# Altium project final_schmatic.PrjPCB
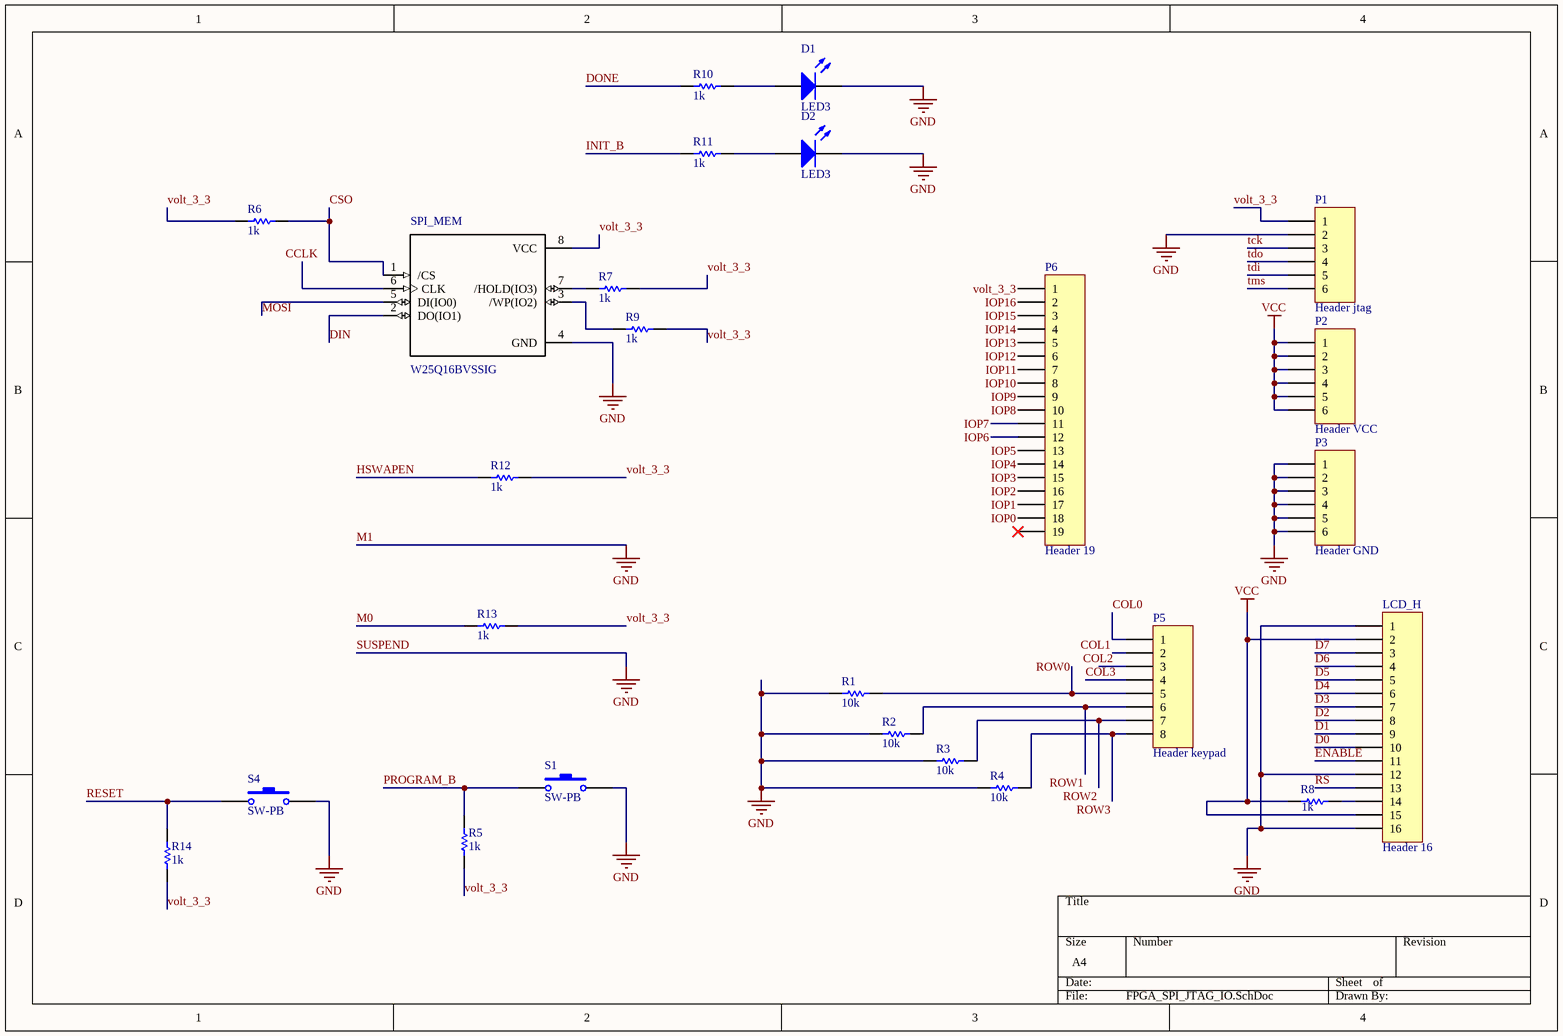
[diagram p0: FPGA_SPI_JTAG_IO.SchDoc]
5 sheets, 58 parts. Net scope: global (net labels, ports and power ports of the same name join across sheets).
Board file: PCB1.PcbDoc
Sheets:
  FPGA_SPI_JTAG_IO.SchDoc
  project1.SchDoc
  Sheet5.SchDoc
  Sheet4.SchDoc
  Sheet1.SchDoc

## Sheet FPGA_SPI_JTAG_IO.SchDoc
size A4

### Parts
D1  LED3  [3.5X2.8X1.9]
D2  LED3  [3.5X2.8X1.9]
LCD_H  Header 16  [HDR1X16]
P1  Header jtag  [HDR1X6]
P2  Header VCC  [HDR1X6]
P3  Header GND  [HDR1X6]
P5  Header keypad  [HDR1X8]
P6  Header 19  [HDR1X19]
R1  10k  [ERA-0805]
R2  10k  [ERA-0805]
R3  10k  [ERA-0805]
R4  10k  [ERA-0805]
R5  1k  [ERA-0805]
R6  1k  [ERA-0805]
R7  1k  [ERA-0805]
R8  1k  [ERA-0805]
R9  1k  [ERA-0805]
R10  1k  [ERA-0805]
R11  1k  [ERA-0805]
R12  1k  [ERA-0805]
R13  1k  [ERA-0805]
R14  1k  [ERA-0805]
S1  SW-PB  [SPST-2]
S4  SW-PB  [SPST-2]
SPI_MEM  W25Q16BVSSIG  [*SOIC127P790X216-8N]

### Nets
M1: D1.2(K) D2.2(K) LCD_H.1 LCD_H.12 LCD_H.16 P1.2 P3.1 P3.2 P3.3 P3.4 P3.5 P3.6 R1.1 R2.1 R3.1 R4.1 S1.2 S4.2 SPI_MEM.4(GND)  [also labelled GND, SUSPEND]
VCC: LCD_H.2 LCD_H.15 P2.1 P2.2 P2.3 P2.4 P2.5 P2.6 R8.1
volt_3_3: P1.1 P6.1 R5.1 R6.1 R7.1 R9.1 R12.1 R13.1 R14.1 SPI_MEM.8(VCC)
CCLK: SPI_MEM.6(CLK)
COL0: P5.1
COL1: P5.2
COL2: P5.3
COL3: P5.4
CSO: R6.2 SPI_MEM.1(/CS)
D0: LCD_H.10
D1: LCD_H.9
D2: LCD_H.8
D3: LCD_H.7
D4: LCD_H.6
D5: LCD_H.5
D6: LCD_H.4
D7: LCD_H.3
DIN: SPI_MEM.2(DO(IO1))
DONE: R10.1
ENABLE: LCD_H.11
HSWAPEN: R12.2
INIT_B: R11.1
IOP0: P6.18
IOP1: P6.17
IOP2: P6.16
IOP3: P6.15
IOP4: P6.14
IOP5: P6.13
IOP6: P6.12
IOP7: P6.11
IOP8: P6.10
IOP9: P6.9
IOP10: P6.8
IOP11: P6.7
IOP12: P6.6
IOP13: P6.5
IOP14: P6.4
IOP15: P6.3
IOP16: P6.2
M0: R13.2
MOSI: SPI_MEM.5(DI(IO0))
PROGRAM_B: R5.2 S1.1
RESET: R14.2 S4.1
ROW0: P5.5 R1.2
ROW1: P5.6 R2.2
ROW2: P5.7 R3.2
ROW3: P5.8 R4.2
RS: LCD_H.13
tck: P1.3
tdi: P1.5
tdo: P1.4
tms: P1.6
NetD1_1: D1.1(A) R10.2
NetD2_1: D2.1(A) R11.2
NetLCD_H_14: LCD_H.14 R8.2
NetR7_2: R7.2 SPI_MEM.7(/HOLD(IO3))
NetR9_2: R9.2 SPI_MEM.3(/WP(IO2))

Not connected (* = marked no-connect by the designer): P6 19*

### Library data of the parts
D1 D2 = LED3: Typical BLUE SiC LED; Published: 8-Jun-2000; LatestRevisionDate: 17-Dec-2003; LatestRevisionNote: PCB Footprint replaced.; DatasheetVersion: 16-Apr-2002; PackageVersion: 16-Apr-2002; PackageReference: 3.5X2.8X1.9; Publisher: Altium Limited; PackageDescription: SM LED; 2 C-Bend Leads; Body 3.5 x 2.8 x 1.9 mm, inc leads (LxWxH typ)
LCD_H = Header 16: Header, 16-Pin; LatestRevisionDate: 17-Jul-2002; LatestRevisionNote: Re-released for DXP Platform.; Publisher: Altium Limited
P1-P3 = Header 6: Header, 6-Pin; LatestRevisionDate: 17-Jul-2002; LatestRevisionNote: Re-released for DXP Platform.; Publisher: Altium Limited
P5 = Header 8: Header, 8-Pin; LatestRevisionDate: 17-Jul-2002; LatestRevisionNote: Re-released for DXP Platform.; Publisher: Altium Limited
P6 = Header 19: Header, 19-Pin; LatestRevisionDate: 17-Jul-2002; LatestRevisionNote: Re-released for DXP Platform.; Publisher: Altium Limited
R1-R14 = ERA6Y: Rectangular Thick Film Chip Resistor, 10 Ohm to 1M Ohm Range, 0.1% and 0.5% Tolerance, 0805 Size, 0.1 W; Note: If flow soldering, adjust pad width of PCB Footprint to 0.7 - 0.8 times the width of the resistor.; Published: 17-Dec-2003; LatestRevisionDate: 19-Mar-2004; LatestRevisionNote: Silkscreen size reduced.; PackageDocument: Mar-2003; PackageReference: ERA-0805; Publisher: Altium Limited; Code_IPC: 2012 [0805]; ComponentLink1Description: Manufacturer Link; ComponentLink1URL: http://www.panasonic.com/industrial/components/resistive_products.htm; ComponentLink2Description: Datasheet; ComponentLink2URL: http://www.panasonic.com/industrial/components/pdf/AOA0000CE8.pdf
S1 S4 = SW-PB: Switch; Published: 24-Mar-1999; LatestRevisionDate: 17-Jul-2002; LatestRevisionNote: Re-released for DXP Platform.; PackageReference: SPST-2; Publisher: Altium Limited; PackageDescription: Switch; 2 Leads
SPI_MEM = W25Q16BVSSIG: Flash, pin, soic, flash, Memory, Semiconductors and Actives, serial, ic; MF: Winbond; SnapEDA_Link: https://www.snapeda.com/parts/W25Q16BVSSIG/Winbond%20Electronics/view-part/?ref=snap; Digi-Key_Part_Number: W25Q16BVSSIG-ND; MP: W25Q16BVSSIG; Digi-Key_Purchase_URL: https://www.digikey.com/product-detail/en/winbond-electronics/W25Q16BVSSIG/W25Q16BVSSIG-ND/2208449?utm_source=snapeda&utm_medium=aggregator&utm_campaign=symbol; Package: SOIC-8 Winbond; Value: *

## Sheet project1.SchDoc
size A
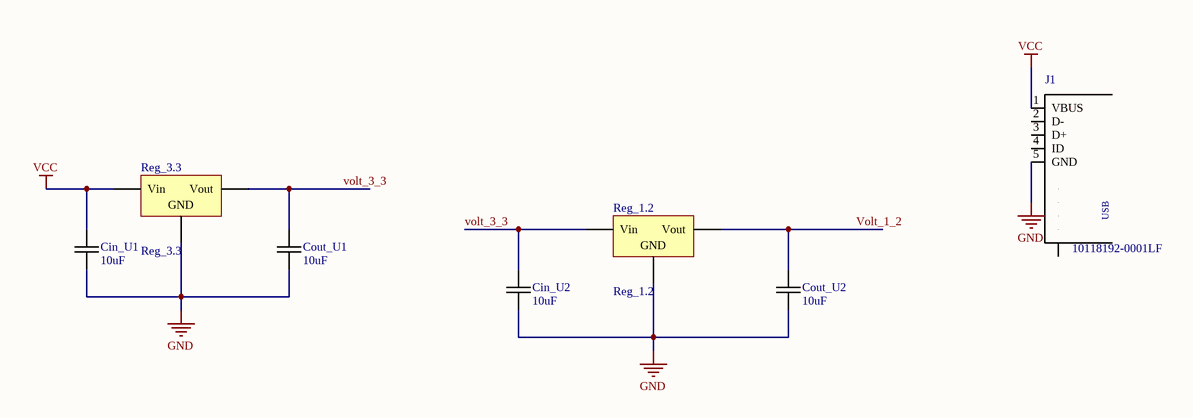
[diagram p1: project1.SchDoc]

### Parts
Cin_U1  10uF  [0805C-GENERIC]
Cin_U2  10uF  [0805C-GENERIC]
Cout_U1  10uF  [0805C-GENERIC]
Cout_U2  10uF  [0805C-GENERIC]
J1  10118192-0001LF  [10118192-0001LF_10118192-0001LF(Primary)]
Reg_1.2  Reg_1.2  [D2PAK_N]
Reg_3.3  Reg_3.3  [D2PAK_N]

### Nets
GND: Cin_U1.2 Cin_U2.2 Cout_U1.2 Cout_U2.2 J1.5(GND) Reg_1.2.2(GND) Reg_3.3.2(GND)  [project net M1]
VCC: Cin_U1.1 J1.1(VBUS) Reg_3.3.1(Vin)
Volt_1_2: Cout_U2.1 Reg_1.2.3(Vout)
volt_3_3: Cin_U2.1 Cout_U1.1 Reg_1.2.1(Vin) Reg_3.3.3(Vout)

Not connected (* = marked no-connect by the designer): J1 2(D-) 3(D+) 4(ID) M1(S) M2(S) S1(S) S2(S) S3(S) S4(S)

### Notes on the sheet
- (in symbol 10118192-0001LF) USB

### Library data of the parts
Cin_U1 Cin_U2 Cout_U1 Cout_U2 = 0805C-10UF-16V-X5R-TDK: CAPACITOR 0805 CERAMIC; Manufacturer Part Number: C2012X5R1C106M; Manufacturer: TDK Corporation; REEL: C63; Supplier 1: Digi-Key; Supplier Part Number 1: 445-4115-2-ND
J1 = 10118192-0001LF: Conn Micro USB Type B RCP 5 POS 0.65mm Solder RA SMD 5 Terminal 1 Port T/R; MF: Amphenol; Price: 0.23 USD; MP: 10118192-0001LF; Availability: Good; SnapEDA_Link: https://www.snapeda.com/parts/10118192-0001LF/Amphenol%20Solar/view-part/?ref=snap; Package: None; Value: *
Reg_1.2 Reg_3.3 = Volt Reg: Voltage Regulator; Published: 24-Mar-1999; LatestRevisionDate: 29-May-2009; LatestRevisionNote: IPC-7351 Footprint Added.; PackageReference: D2PAK; Publisher: Altium Limited; PackageDescription: 3-Pin Transistor Outline Package 2.54 mm Pitch, 15.1 mm Lead Span

## Sheet Sheet5.SchDoc
size A4
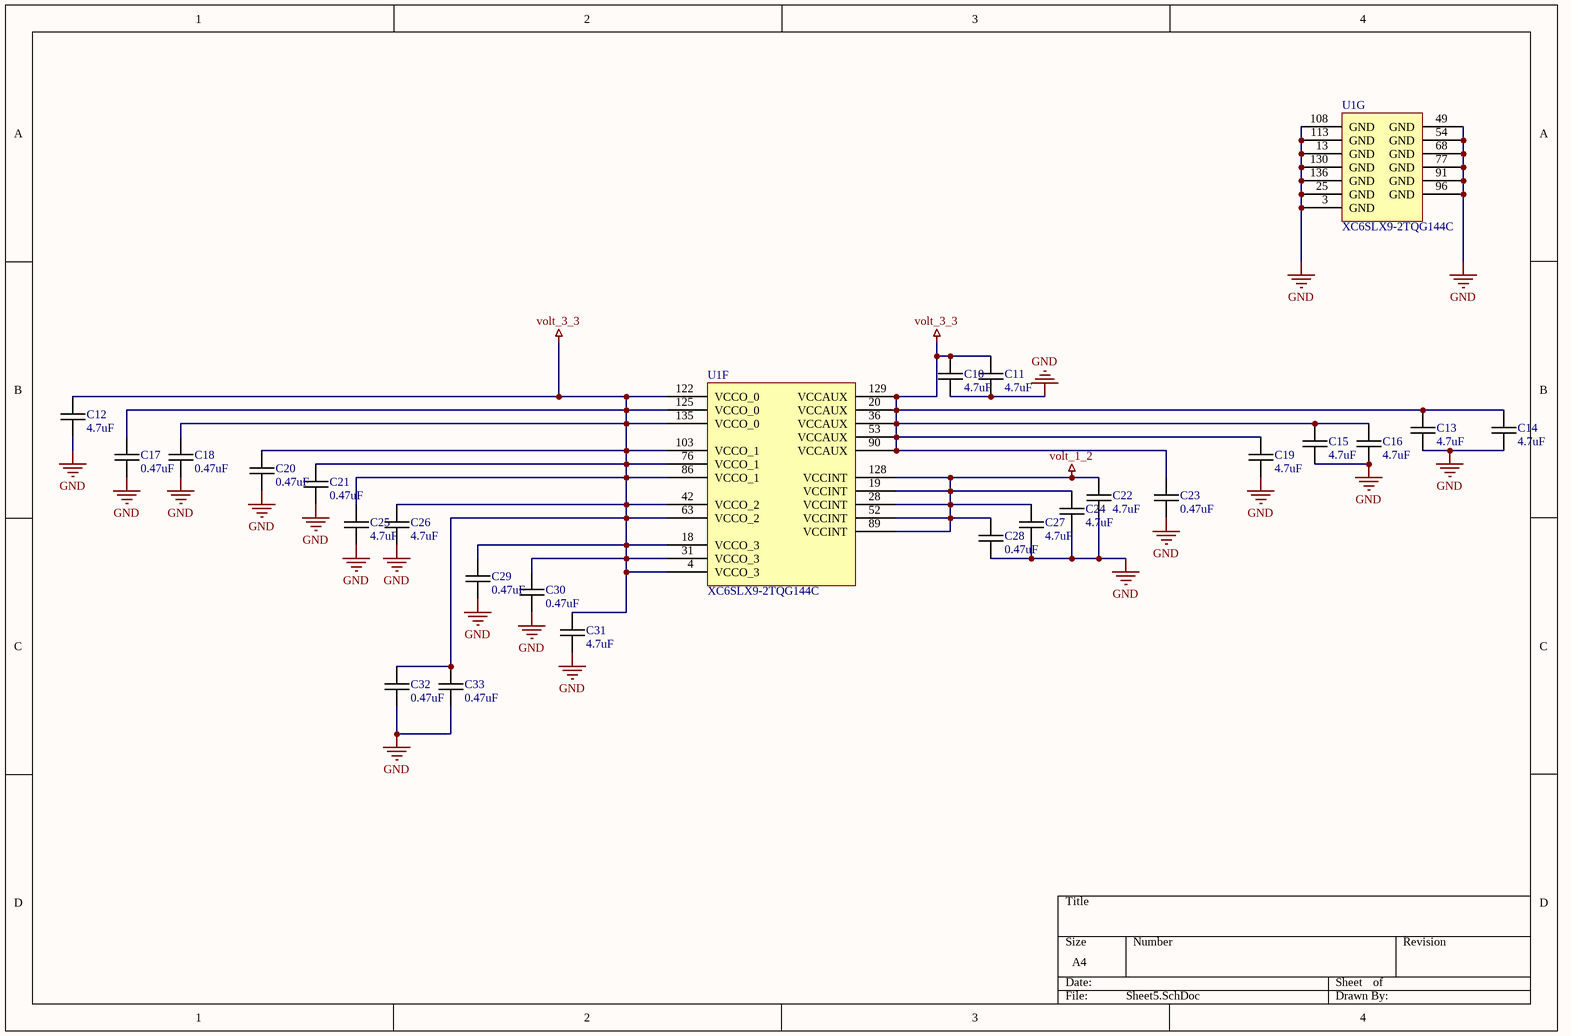
[diagram p2: Sheet5.SchDoc]

### Parts
C10  4.7uF  [0805C-GENERIC]
C11  4.7uF  [0805C-GENERIC]
C12  4.7uF  [0805C-GENERIC]
C13  4.7uF  [0805C-GENERIC]
C14  4.7uF  [0805C-GENERIC]
C15  4.7uF  [0805C-GENERIC]
C16  4.7uF  [0805C-GENERIC]
C17  0.47uF  [0805C-GENERIC]
C18  0.47uF  [0805C-GENERIC]
C19  4.7uF  [0805C-GENERIC]
C20  0.47uF  [0805C-GENERIC]
C21  0.47uF  [0805C-GENERIC]
C22  4.7uF  [0805C-GENERIC]
C23  0.47uF  [0805C-GENERIC]
C24  4.7uF  [0805C-GENERIC]
C25  4.7uF  [0805C-GENERIC]
C26  4.7uF  [0805C-GENERIC]
C27  4.7uF  [0805C-GENERIC]
C28  0.47uF  [0805C-GENERIC]
C29  0.47uF  [0805C-GENERIC]
C30  0.47uF  [0805C-GENERIC]
C31  4.7uF  [0805C-GENERIC]
C32  0.47uF  [0805C-GENERIC]
C33  0.47uF  [0805C-GENERIC]
U1  XC6SLX9-2TQG144C  [TQG144_N]  (parts F,G of 7)

### Nets
GND: C10.2 C11.2 C12.2 C13.2 C14.2 C15.2 C16.2 C17.2 C18.2 C19.2 C20.2 C21.2 C22.2 C23.2 C24.2 C25.2 C26.2 C27.2 C28.2 C29.2 C30.2 C31.2 C32.2 C33.2 U1.3(GND) U1.13(GND) U1.25(GND) U1.49(GND) U1.54(GND) U1.68(GND) U1.77(GND) U1.91(GND) U1.96(GND) U1.108(GND) U1.113(GND) U1.130(GND) U1.136(GND)  [project net M1]
Volt_1_2: C22.1 C24.1 C27.1 C28.1 U1.19(VCCINT) U1.28(VCCINT) U1.52(VCCINT) U1.89(VCCINT) U1.128(VCCINT)
volt_3_3: C10.1 C11.1 C12.1 C13.1 C14.1 C15.1 C16.1 C17.1 C18.1 C19.1 C20.1 C21.1 C23.1 C25.1 C26.1 C29.1 C30.1 C31.1 C32.1 C33.1 U1.4(VCCO_3) U1.18(VCCO_3) U1.20(VCCAUX) U1.31(VCCO_3) U1.36(VCCAUX) U1.42(VCCO_2) U1.53(VCCAUX) U1.63(VCCO_2) U1.76(VCCO_1) U1.86(VCCO_1) U1.90(VCCAUX) U1.103(VCCO_1) U1.122(VCCO_0) U1.125(VCCO_0) U1.129(VCCAUX) U1.135(VCCO_0)

### Library data of the parts
C10-C33 = 0805C-4U7-25V-X5R-TDK: CAPACITOR 0805 CERAMIC; Manufacturer: TDK Corporation; Manufacturer Part Number: C2012X5R1E475K; Tolerance: ±10%; Voltage - Rated: 25V; Temperature Coefficient: X5R; Capacitance: 4.7µF; REEL: C102; Supplier 1: Digi-Key; Supplier Part Number 1: 445-4116-1-ND; Packaging: Cut Tape (CT); Operating Temperature: -55°C ~ 85°C; Supplier: Digi-Key; Thickness: 1.25mm; RoHS: RoHS Compliant; Features: General Purpose; Mounting Type: Surface Mount, MLCC; Package / Case: 0805 (2012 Metric); Lead Spacing: -; Category: Capacitors; Supplier Part Number: 445-4116-1-ND
U1 = XC6SLX9-2TQG144C: Spartan-6 LX 1.2V FPGA, 102 User I/Os, 144-Pin TQFP (0.5mm Pitch), Speed Grade 2, Commercial Grade, Pb-Free; DatasheetVersion: ver1.6, Nov-2010; PackageVersion: ver1.2, Jun-2004; PackageReference: TQG144; PackageDescription: 144-Pin Thin Quad Flat Pack (TQG144) - Pb-Free; Code_JEDEC: MS-026-BFB; ComponentLink1Description: Manufacturer URL; ComponentLink1URL: http://www.xilinx.com/; ComponentLink2Description: Spartan-6 Datasheet; ComponentLink2URL: http://www.xilinx.com/support/documentation/data_sheets/ds160.pdf; ComponentLink3Description: Spartan-6 Documents; ComponentLink3URL: http://www.xilinx.com/support/documentation/spartan-6.htm

## Sheet Sheet4.SchDoc
size A4
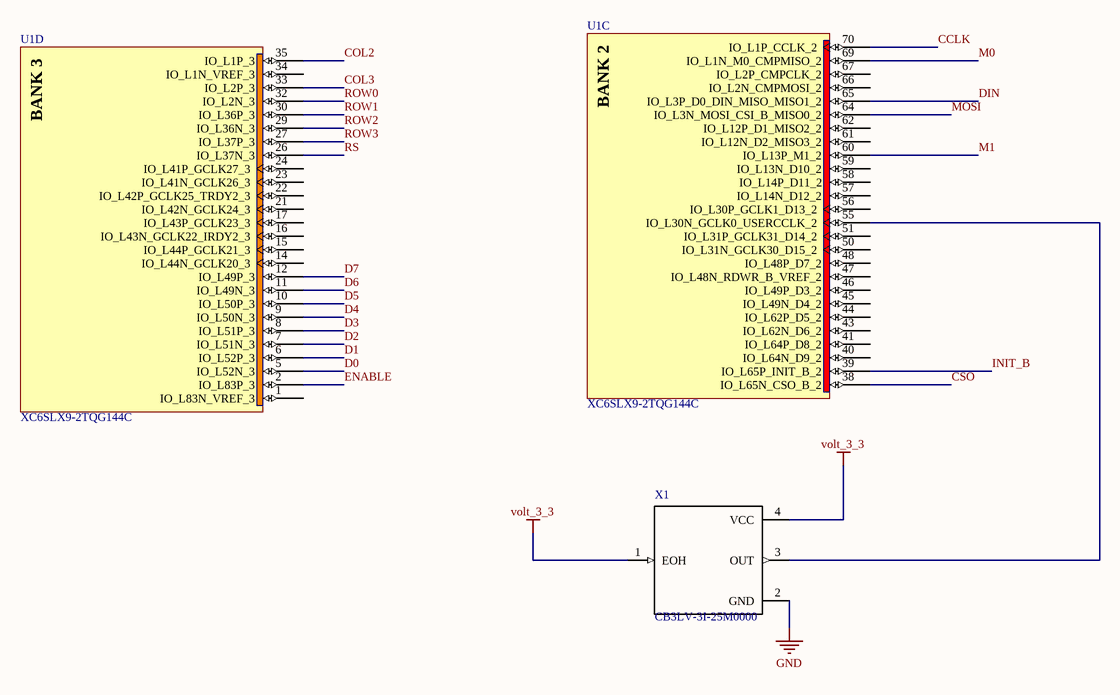
[diagram p3: Sheet4.SchDoc]

### Parts
U1  XC6SLX9-2TQG144C  [TQG144_N]  (parts C,D of 7)
X1  CB3LV-3I-25M0000  [*OSCCC700X500X180-4N]

### Nets
M1: U1.60(IO_L13P_M1_2) X1.2(GND)  [also labelled GND]
volt_3_3: X1.1(EOH) X1.4(VCC)
CCLK: U1.70(IO_L1P_CCLK_2)
COL2: U1.35(IO_L1P_3)
COL3: U1.33(IO_L2P_3)
CSO: U1.38(IO_L65N_CSO_B_2)
D0: U1.5(IO_L52N_3)
D1: U1.6(IO_L52P_3)
D2: U1.7(IO_L51N_3)
D3: U1.8(IO_L51P_3)
D4: U1.9(IO_L50N_3)
D5: U1.10(IO_L50P_3)
D6: U1.11(IO_L49N_3)
D7: U1.12(IO_L49P_3)
DIN: U1.65(IO_L3P_D0_DIN_MISO_MISO1_2)
ENABLE: U1.2(IO_L83P_3)
INIT_B: U1.39(IO_L65P_INIT_B_2)
M0: U1.69(IO_L1N_M0_CMPMISO_2)
MOSI: U1.64(IO_L3N_MOSI_CSI_B_MISO0_2)
ROW0: U1.32(IO_L2N_3)
ROW1: U1.30(IO_L36P_3)
ROW2: U1.29(IO_L36N_3)
ROW3: U1.27(IO_L37P_3)
RS: U1.26(IO_L37N_3)
NetU1_55: U1.55(IO_L30N_GCLK0_USERCCLK_2) X1.3(OUT)

Not connected (* = marked no-connect by the designer): U1 1(IO_L83N_VREF_3) 14(IO_L44N_GCLK20_3) 15(IO_L44P_GCLK21_3) 16(IO_L43N_GCLK22_IRDY2_3) 17(IO_L43P_GCLK23_3) 21(IO_L42N_GCLK24_3) 22(IO_L42P_GCLK25_TRDY2_3) 23(IO_L41N_GCLK26_3) 24(IO_L41P_GCLK27_3) 34(IO_L1N_VREF_3) 40(IO_L64N_D9_2) 41(IO_L64P_D8_2) 43(IO_L62N_D6_2) 44(IO_L62P_D5_2) 45(IO_L49N_D4_2) 46(IO_L49P_D3_2) 47(IO_L48N_RDWR_B_VREF_2) 48(IO_L48P_D7_2) 50(IO_L31N_GCLK30_D15_2) 51(IO_L31P_GCLK31_D14_2) 56(IO_L30P_GCLK1_D13_2) 57(IO_L14N_D12_2) 58(IO_L14P_D11_2) 59(IO_L13N_D10_2) 61(IO_L12N_D2_MISO3_2) 62(IO_L12P_D1_MISO2_2) 66(IO_L2N_CMPMOSI_2) 67(IO_L2P_CMPCLK_2)

### Notes on the sheet
- (in symbol XC6SLX9-2TQG144C, part C) BANK 2
- (in symbol XC6SLX9-2TQG144C, part D) BANK 3

### Library data of the parts
U1 = XC6SLX9-2TQG144C: as U1 on sheet Sheet5; DatasheetVersion: ver1.6, Nov-2010; PackageVersion: ver1.2, Jun-2004; PackageReference: TQG144; PackageDescription: 144-Pin Thin Quad Flat Pack (TQG144) - Pb-Free; Code_JEDEC: MS-026-BFB; ComponentLink1Description: Manufacturer URL; ComponentLink1URL: http://www.xilinx.com/; ComponentLink2Description: Spartan-6 Datasheet; ComponentLink2URL: http://www.xilinx.com/support/documentation/data_sheets/ds160.pdf; ComponentLink3Description: Spartan-6 Documents; ComponentLink3URL: http://www.xilinx.com/support/documentation/spartan-6.htm
X1 = CB3LV-3I-25M0000: CB3LV Series 25 MHz 7 x 5 mm 3.3 V آ±50 ppm SMT HCMOS/TTL Clock Oscillator; MF: CTS-Frequency; MP: CB3LV-3I-25M0000; SnapEDA_Link: https://www.snapeda.com/parts/CB3LV-3I-25M0000/CTS-Frequency%20Controls/view-part/?ref=snap; Package: SMD-4 CTS Components; Availability: Unavailable; Price: None; Value: *

## Sheet Sheet1.SchDoc
size A4
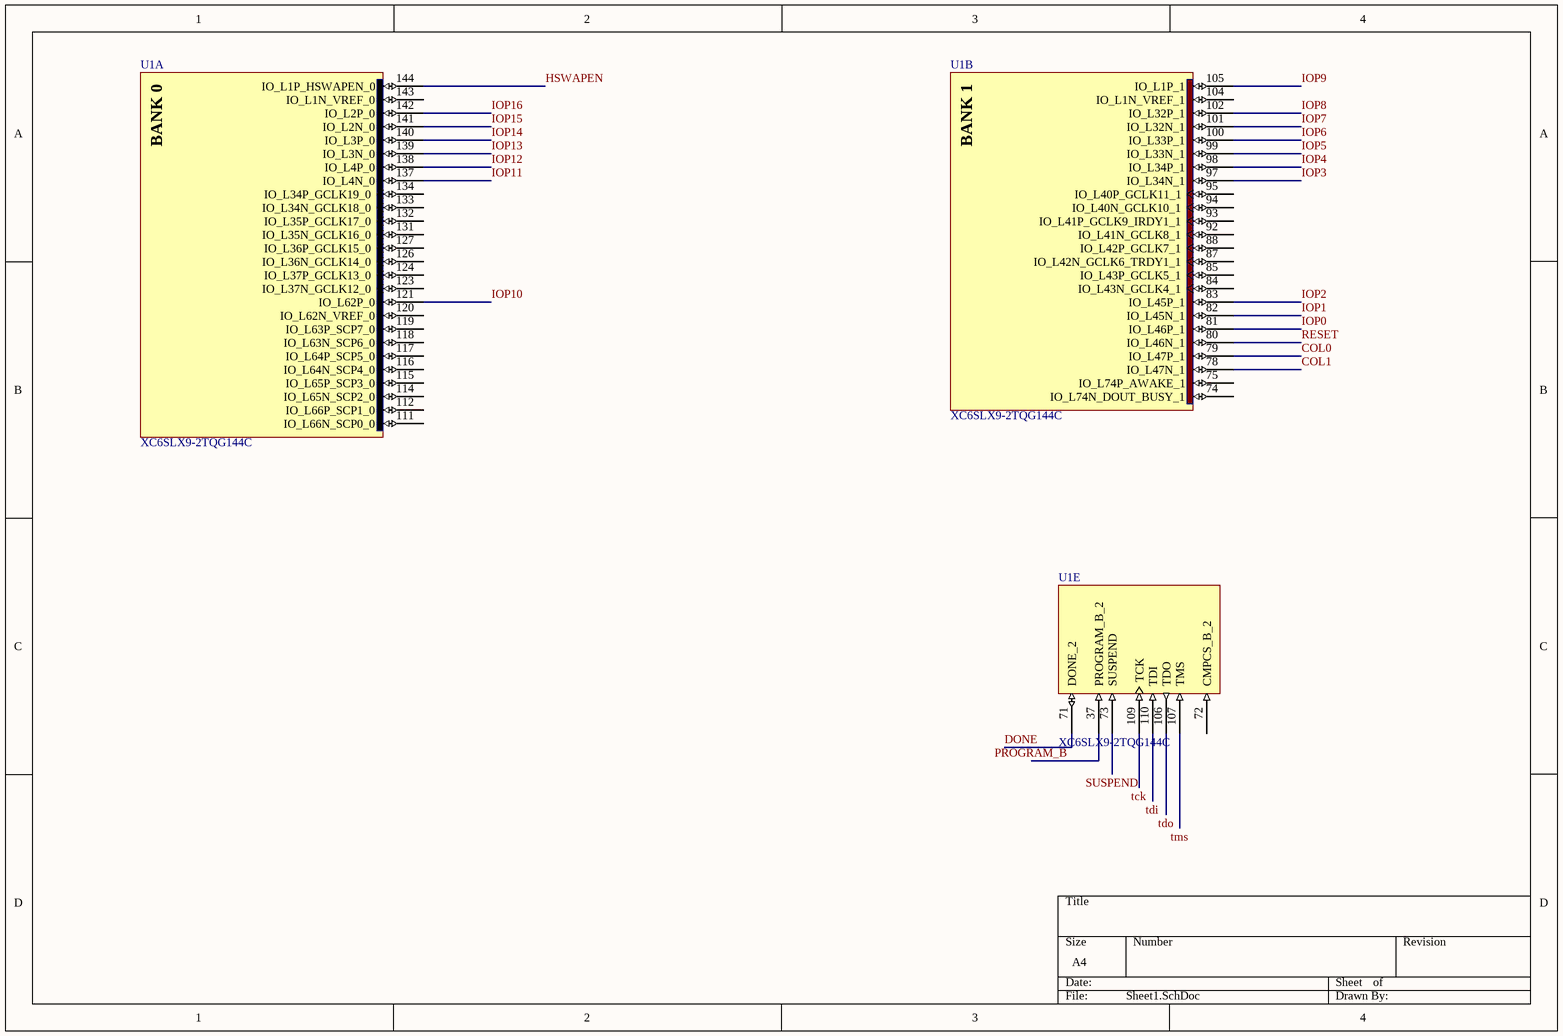
[diagram p4: Sheet1.SchDoc]

### Parts
U1  XC6SLX9-2TQG144C  [TQG144_N]  (parts A,B,E of 7)

### Nets
SUSPEND: U1.73(SUSPEND)  [project net M1]
COL0: U1.79(IO_L47P_1)
COL1: U1.78(IO_L47N_1)
DONE: U1.71(DONE_2)
HSWAPEN: U1.144(IO_L1P_HSWAPEN_0)
IOP0: U1.81(IO_L46P_1)
IOP1: U1.82(IO_L45N_1)
IOP2: U1.83(IO_L45P_1)
IOP3: U1.97(IO_L34N_1)
IOP4: U1.98(IO_L34P_1)
IOP5: U1.99(IO_L33N_1)
IOP6: U1.100(IO_L33P_1)
IOP7: U1.101(IO_L32N_1)
IOP8: U1.102(IO_L32P_1)
IOP9: U1.105(IO_L1P_1)
IOP10: U1.121(IO_L62P_0)
IOP11: U1.137(IO_L4N_0)
IOP12: U1.138(IO_L4P_0)
IOP13: U1.139(IO_L3N_0)
IOP14: U1.140(IO_L3P_0)
IOP15: U1.141(IO_L2N_0)
IOP16: U1.142(IO_L2P_0)
PROGRAM_B: U1.37(PROGRAM_B_2)
RESET: U1.80(IO_L46N_1)
tck: U1.109(TCK)
tdi: U1.110(TDI)
tdo: U1.106(TDO)
tms: U1.107(TMS)

Not connected (* = marked no-connect by the designer): U1 72(CMPCS_B_2) 74(IO_L74N_DOUT_BUSY_1) 75(IO_L74P_AWAKE_1) 84(IO_L43N_GCLK4_1) 85(IO_L43P_GCLK5_1) 87(IO_L42N_GCLK6_TRDY1_1) 88(IO_L42P_GCLK7_1) 92(IO_L41N_GCLK8_1) 93(IO_L41P_GCLK9_IRDY1_1) 94(IO_L40N_GCLK10_1) 95(IO_L40P_GCLK11_1) 104(IO_L1N_VREF_1) 111(IO_L66N_SCP0_0) 112(IO_L66P_SCP1_0) 114(IO_L65N_SCP2_0) 115(IO_L65P_SCP3_0) 116(IO_L64N_SCP4_0) 117(IO_L64P_SCP5_0) 118(IO_L63N_SCP6_0) 119(IO_L63P_SCP7_0) 120(IO_L62N_VREF_0) 123(IO_L37N_GCLK12_0) 124(IO_L37P_GCLK13_0) 126(IO_L36N_GCLK14_0) 127(IO_L36P_GCLK15_0) 131(IO_L35N_GCLK16_0) 132(IO_L35P_GCLK17_0) 133(IO_L34N_GCLK18_0) 134(IO_L34P_GCLK19_0) 143(IO_L1N_VREF_0)

### Notes on the sheet
- (in symbol XC6SLX9-2TQG144C, part A) BANK 0
- (in symbol XC6SLX9-2TQG144C, part B) BANK 1

### Library data of the parts
U1 = XC6SLX9-2TQG144C: as U1 on sheet Sheet5; DatasheetVersion: ver1.6, Nov-2010; PackageVersion: ver1.2, Jun-2004; PackageReference: TQG144; PackageDescription: 144-Pin Thin Quad Flat Pack (TQG144) - Pb-Free; Code_JEDEC: MS-026-BFB; ComponentLink1Description: Manufacturer URL; ComponentLink1URL: http://www.xilinx.com/; ComponentLink2Description: Spartan-6 Datasheet; ComponentLink2URL: http://www.xilinx.com/support/documentation/data_sheets/ds160.pdf; ComponentLink3Description: Spartan-6 Documents; ComponentLink3URL: http://www.xilinx.com/support/documentation/spartan-6.htm

## Nets that join several sheets
M1: FPGA_SPI_JTAG_IO (19 pins), project1 (7 pins), Sheet5 (37 pins), Sheet4 (U1.60 X1.2), Sheet1 (U1.73)
VCC: FPGA_SPI_JTAG_IO (9 pins), project1 (Cin_U1.1 J1.1 Reg_3.3.1)
Volt_1_2: project1 (Cout_U2.1 Reg_1.2.3), Sheet5 (9 pins)
volt_3_3: FPGA_SPI_JTAG_IO (10 pins), project1 (Cin_U2.1 Cout_U1.1 Reg_1.2.1 Reg_3.3.3), Sheet5 (36 pins), Sheet4 (X1.1 X1.4)
CCLK: FPGA_SPI_JTAG_IO (SPI_MEM.6), Sheet4 (U1.70)
COL0: FPGA_SPI_JTAG_IO (P5.1), Sheet1 (U1.79)
COL1: FPGA_SPI_JTAG_IO (P5.2), Sheet1 (U1.78)
COL2: FPGA_SPI_JTAG_IO (P5.3), Sheet4 (U1.35)
COL3: FPGA_SPI_JTAG_IO (P5.4), Sheet4 (U1.33)
CSO: FPGA_SPI_JTAG_IO (R6.2 SPI_MEM.1), Sheet4 (U1.38)
D0: FPGA_SPI_JTAG_IO (LCD_H.10), Sheet4 (U1.5)
D1: FPGA_SPI_JTAG_IO (LCD_H.9), Sheet4 (U1.6)
D2: FPGA_SPI_JTAG_IO (LCD_H.8), Sheet4 (U1.7)
D3: FPGA_SPI_JTAG_IO (LCD_H.7), Sheet4 (U1.8)
D4: FPGA_SPI_JTAG_IO (LCD_H.6), Sheet4 (U1.9)
D5: FPGA_SPI_JTAG_IO (LCD_H.5), Sheet4 (U1.10)
D6: FPGA_SPI_JTAG_IO (LCD_H.4), Sheet4 (U1.11)
D7: FPGA_SPI_JTAG_IO (LCD_H.3), Sheet4 (U1.12)
DIN: FPGA_SPI_JTAG_IO (SPI_MEM.2), Sheet4 (U1.65)
DONE: FPGA_SPI_JTAG_IO (R10.1), Sheet1 (U1.71)
ENABLE: FPGA_SPI_JTAG_IO (LCD_H.11), Sheet4 (U1.2)
HSWAPEN: FPGA_SPI_JTAG_IO (R12.2), Sheet1 (U1.144)
INIT_B: FPGA_SPI_JTAG_IO (R11.1), Sheet4 (U1.39)
IOP0: FPGA_SPI_JTAG_IO (P6.18), Sheet1 (U1.81)
IOP1: FPGA_SPI_JTAG_IO (P6.17), Sheet1 (U1.82)
IOP2: FPGA_SPI_JTAG_IO (P6.16), Sheet1 (U1.83)
IOP3: FPGA_SPI_JTAG_IO (P6.15), Sheet1 (U1.97)
IOP4: FPGA_SPI_JTAG_IO (P6.14), Sheet1 (U1.98)
IOP5: FPGA_SPI_JTAG_IO (P6.13), Sheet1 (U1.99)
IOP6: FPGA_SPI_JTAG_IO (P6.12), Sheet1 (U1.100)
IOP7: FPGA_SPI_JTAG_IO (P6.11), Sheet1 (U1.101)
IOP8: FPGA_SPI_JTAG_IO (P6.10), Sheet1 (U1.102)
IOP9: FPGA_SPI_JTAG_IO (P6.9), Sheet1 (U1.105)
IOP10: FPGA_SPI_JTAG_IO (P6.8), Sheet1 (U1.121)
IOP11: FPGA_SPI_JTAG_IO (P6.7), Sheet1 (U1.137)
IOP12: FPGA_SPI_JTAG_IO (P6.6), Sheet1 (U1.138)
IOP13: FPGA_SPI_JTAG_IO (P6.5), Sheet1 (U1.139)
IOP14: FPGA_SPI_JTAG_IO (P6.4), Sheet1 (U1.140)
IOP15: FPGA_SPI_JTAG_IO (P6.3), Sheet1 (U1.141)
IOP16: FPGA_SPI_JTAG_IO (P6.2), Sheet1 (U1.142)
M0: FPGA_SPI_JTAG_IO (R13.2), Sheet4 (U1.69)
MOSI: FPGA_SPI_JTAG_IO (SPI_MEM.5), Sheet4 (U1.64)
PROGRAM_B: FPGA_SPI_JTAG_IO (R5.2 S1.1), Sheet1 (U1.37)
RESET: FPGA_SPI_JTAG_IO (R14.2 S4.1), Sheet1 (U1.80)
ROW0: FPGA_SPI_JTAG_IO (P5.5 R1.2), Sheet4 (U1.32)
ROW1: FPGA_SPI_JTAG_IO (P5.6 R2.2), Sheet4 (U1.30)
ROW2: FPGA_SPI_JTAG_IO (P5.7 R3.2), Sheet4 (U1.29)
ROW3: FPGA_SPI_JTAG_IO (P5.8 R4.2), Sheet4 (U1.27)
RS: FPGA_SPI_JTAG_IO (LCD_H.13), Sheet4 (U1.26)
tck: FPGA_SPI_JTAG_IO (P1.3), Sheet1 (U1.109)
tdi: FPGA_SPI_JTAG_IO (P1.5), Sheet1 (U1.110)
tdo: FPGA_SPI_JTAG_IO (P1.4), Sheet1 (U1.106)
tms: FPGA_SPI_JTAG_IO (P1.6), Sheet1 (U1.107)